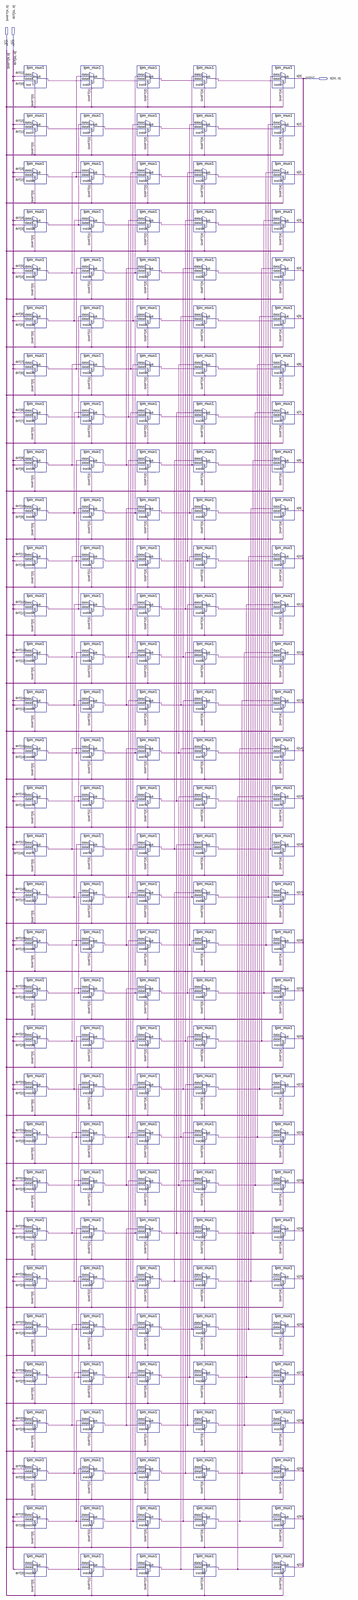
[diagram p0: schematic sheet, whole]
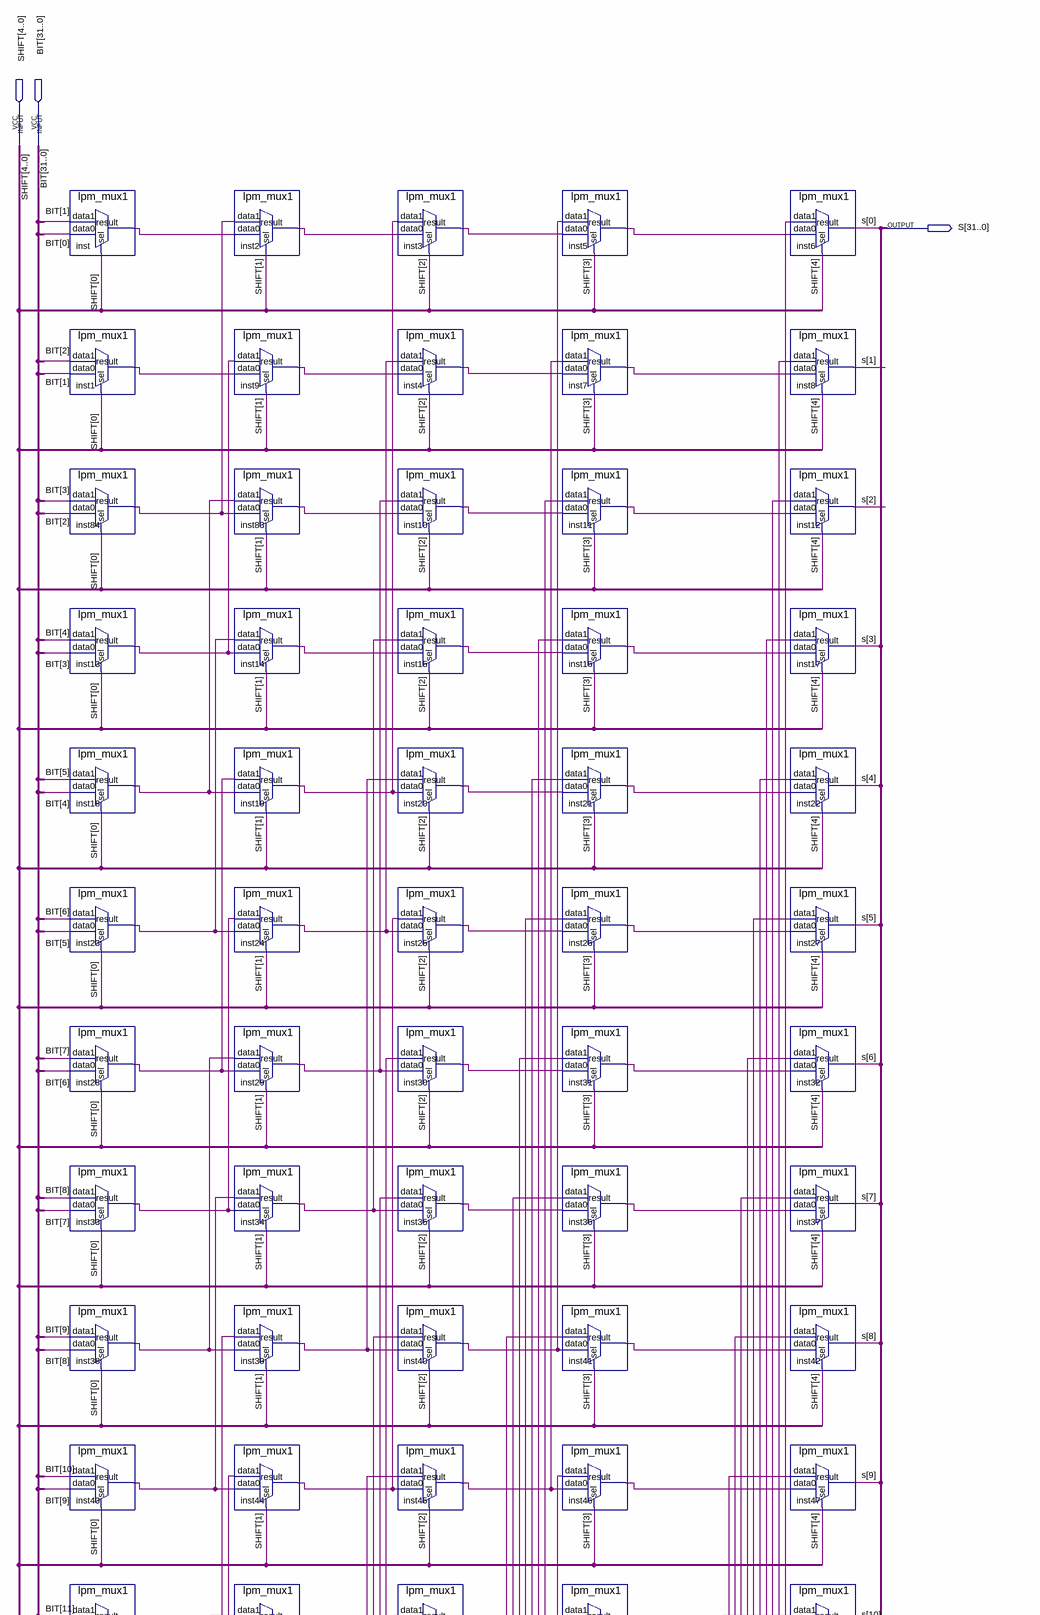
[diagram p1: schematic sheet, upper part]
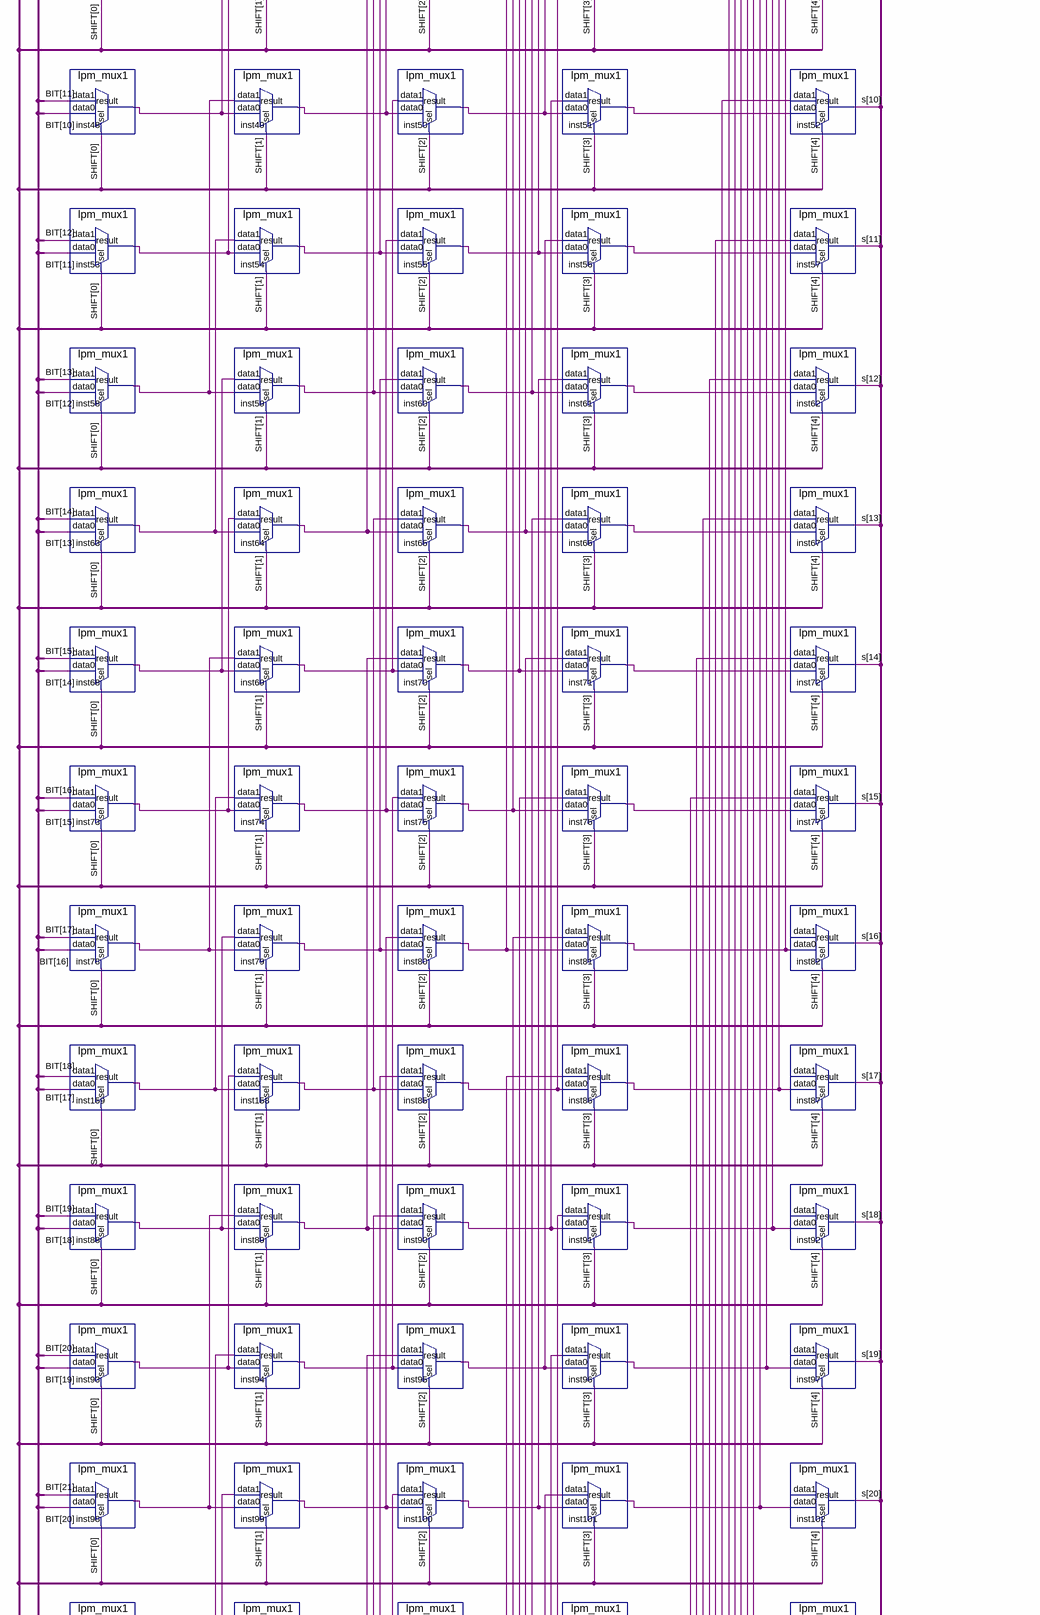
[diagram p2: schematic sheet, middle part]
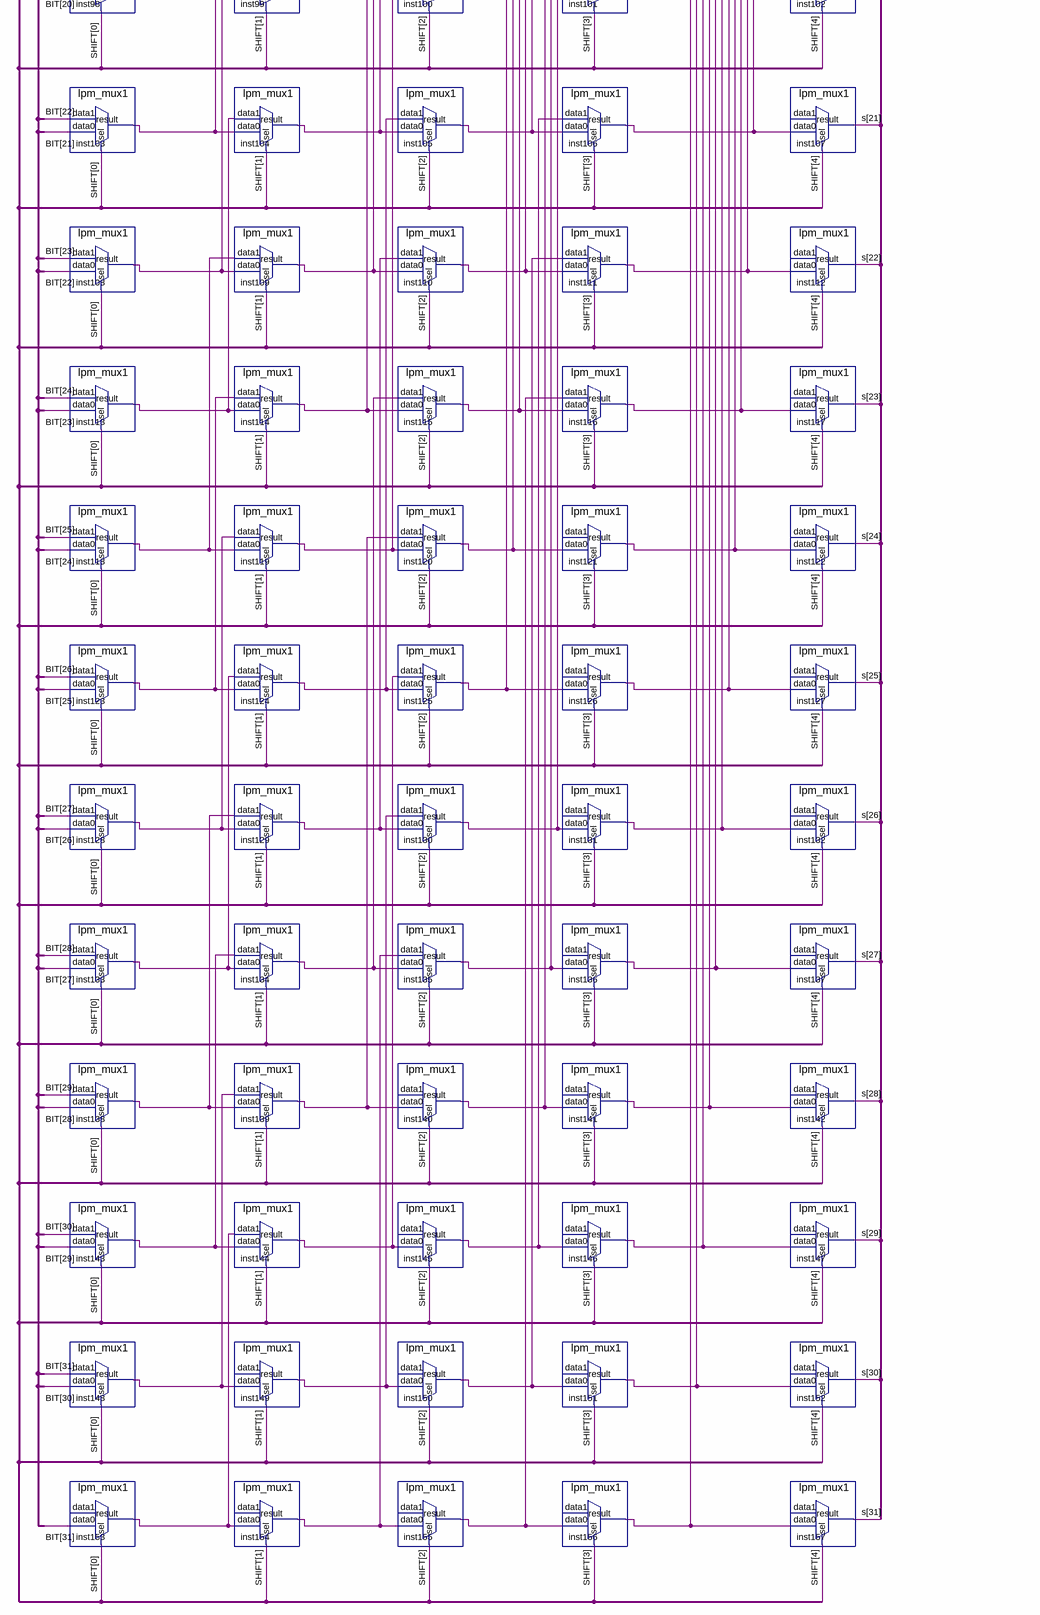
[diagram p3: schematic sheet, lower part]
// Quartus schematic SRL.bdf as structural Verilog: 160 symbols, 3 pins
module SRL (
  input  [4:0] SHIFT,
  input  [31:0] BIT,
  output [31:0] S
);

  wire inst1_result, inst2_result, inst3_result, inst4_result, inst5_result, inst7_result, inst9_result,
       inst10_result, inst11_result, inst13_result, inst14_result, inst15_result, inst16_result,
       inst18_result, inst19_result, inst20_result, inst21_result, inst23_result, inst24_result,
       inst25_result, inst26_result, inst28_result, inst29_result, inst30_result, inst31_result,
       inst33_result, inst34_result, inst35_result, inst36_result, inst38_result, inst39_result,
       inst40_result, inst41_result, inst43_result, inst44_result, inst45_result, inst46_result,
       inst48_result, inst49_result, inst50_result, inst51_result, inst53_result, inst54_result,
       inst55_result, inst56_result, inst58_result, inst59_result, inst60_result, inst61_result,
       inst63_result, inst64_result, inst65_result, inst66_result, inst68_result, inst69_result,
       inst70_result, inst71_result, inst73_result, inst74_result, inst75_result, inst76_result,
       inst78_result, inst79_result, inst80_result, inst81_result, inst83_result, inst84_result,
       inst85_result, inst86_result, inst88_result, inst89_result, inst90_result, inst91_result,
       inst93_result, inst94_result, inst95_result, inst96_result, inst98_result, inst99_result,
       inst100_result, inst101_result, inst103_result, inst104_result, inst105_result, inst106_result,
       inst108_result, inst109_result, inst110_result, inst111_result, inst113_result, inst114_result,
       inst115_result, inst116_result, inst118_result, inst119_result, inst120_result, inst121_result,
       inst123_result, inst124_result, inst125_result, inst126_result, inst128_result, inst129_result,
       inst130_result, inst131_result, inst133_result, inst134_result, inst135_result, inst136_result,
       inst138_result, inst139_result, inst140_result, inst141_result, inst143_result, inst144_result,
       inst145_result, inst146_result, inst148_result, inst149_result, inst150_result, inst151_result,
       inst153_result, inst154_result, inst155_result, inst156_result, inst158_result, inst159_result,
       inst_result;

  lpm_mux1 inst (.data1(BIT[1]), .data0(BIT[0]), .sel(SHIFT[0]), .result(inst_result));
  lpm_mux1 inst1 (.data1(BIT[2]), .data0(BIT[1]), .sel(SHIFT[0]), .result(inst1_result));
  lpm_mux1 inst84 (.data1(BIT[3]), .data0(BIT[2]), .sel(SHIFT[0]), .result(inst84_result));
  lpm_mux1 inst13 (.data1(BIT[4]), .data0(BIT[3]), .sel(SHIFT[0]), .result(inst13_result));
  lpm_mux1 inst18 (.data1(BIT[5]), .data0(BIT[4]), .sel(SHIFT[0]), .result(inst18_result));
  lpm_mux1 inst23 (.data1(BIT[6]), .data0(BIT[5]), .sel(SHIFT[0]), .result(inst23_result));
  lpm_mux1 inst28 (.data1(BIT[7]), .data0(BIT[6]), .sel(SHIFT[0]), .result(inst28_result));
  lpm_mux1 inst33 (.data1(BIT[8]), .data0(BIT[7]), .sel(SHIFT[0]), .result(inst33_result));
  lpm_mux1 inst38 (.data1(BIT[9]), .data0(BIT[8]), .sel(SHIFT[0]), .result(inst38_result));
  lpm_mux1 inst43 (.data1(BIT[10]), .data0(BIT[9]), .sel(SHIFT[0]), .result(inst43_result));
  lpm_mux1 inst48 (.data1(BIT[11]), .data0(BIT[10]), .sel(SHIFT[0]), .result(inst48_result));
  lpm_mux1 inst53 (.data1(BIT[12]), .data0(BIT[11]), .sel(SHIFT[0]), .result(inst53_result));
  lpm_mux1 inst58 (.data1(BIT[13]), .data0(BIT[12]), .sel(SHIFT[0]), .result(inst58_result));
  lpm_mux1 inst63 (.data1(BIT[14]), .data0(BIT[13]), .sel(SHIFT[0]), .result(inst63_result));
  lpm_mux1 inst68 (.data1(BIT[15]), .data0(BIT[14]), .sel(SHIFT[0]), .result(inst68_result));
  lpm_mux1 inst73 (.data1(BIT[16]), .data0(BIT[15]), .sel(SHIFT[0]), .result(inst73_result));
  lpm_mux1 inst78 (.data1(BIT[17]), .data0(BIT[16]), .sel(SHIFT[0]), .result(inst78_result));
  lpm_mux1 inst159 (.data1(BIT[18]), .data0(BIT[17]), .sel(SHIFT[0]), .result(inst159_result));
  lpm_mux1 inst88 (.data1(BIT[19]), .data0(BIT[18]), .sel(SHIFT[0]), .result(inst88_result));
  lpm_mux1 inst93 (.data1(BIT[20]), .data0(BIT[19]), .sel(SHIFT[0]), .result(inst93_result));
  lpm_mux1 inst98 (.data1(BIT[21]), .data0(BIT[20]), .sel(SHIFT[0]), .result(inst98_result));
  lpm_mux1 inst103 (.data1(BIT[22]), .data0(BIT[21]), .sel(SHIFT[0]), .result(inst103_result));
  lpm_mux1 inst108 (.data1(BIT[23]), .data0(BIT[22]), .sel(SHIFT[0]), .result(inst108_result));
  lpm_mux1 inst113 (.data1(BIT[24]), .data0(BIT[23]), .sel(SHIFT[0]), .result(inst113_result));
  lpm_mux1 inst118 (.data1(BIT[25]), .data0(BIT[24]), .sel(SHIFT[0]), .result(inst118_result));
  lpm_mux1 inst123 (.data1(BIT[26]), .data0(BIT[25]), .sel(SHIFT[0]), .result(inst123_result));
  lpm_mux1 inst128 (.data1(BIT[27]), .data0(BIT[26]), .sel(SHIFT[0]), .result(inst128_result));
  lpm_mux1 inst133 (.data1(BIT[28]), .data0(BIT[27]), .sel(SHIFT[0]), .result(inst133_result));
  lpm_mux1 inst138 (.data1(BIT[29]), .data0(BIT[28]), .sel(SHIFT[0]), .result(inst138_result));
  lpm_mux1 inst143 (.data1(BIT[30]), .data0(BIT[29]), .sel(SHIFT[0]), .result(inst143_result));
  lpm_mux1 inst148 (.data1(BIT[31]), .data0(BIT[30]), .sel(SHIFT[0]), .result(inst148_result));
  lpm_mux1 inst153 (.data0(BIT[31]), .sel(SHIFT[0]), .result(inst153_result));  // open: data1
  lpm_mux1 inst2 (.data1(inst84_result), .data0(inst_result), .sel(SHIFT[1]), .result(inst2_result));
  lpm_mux1 inst9 (.data1(inst13_result), .data0(inst1_result), .sel(SHIFT[1]), .result(inst9_result));
  lpm_mux1 inst83 (.data1(inst18_result), .data0(inst84_result), .sel(SHIFT[1]), .result(inst83_result));
  lpm_mux1 inst14 (.data1(inst23_result), .data0(inst13_result), .sel(SHIFT[1]), .result(inst14_result));
  lpm_mux1 inst19 (.data1(inst28_result), .data0(inst18_result), .sel(SHIFT[1]), .result(inst19_result));
  lpm_mux1 inst24 (.data1(inst33_result), .data0(inst23_result), .sel(SHIFT[1]), .result(inst24_result));
  lpm_mux1 inst29 (.data1(inst38_result), .data0(inst28_result), .sel(SHIFT[1]), .result(inst29_result));
  lpm_mux1 inst34 (.data1(inst43_result), .data0(inst33_result), .sel(SHIFT[1]), .result(inst34_result));
  lpm_mux1 inst39 (.data1(inst48_result), .data0(inst38_result), .sel(SHIFT[1]), .result(inst39_result));
  lpm_mux1 inst44 (.data1(inst53_result), .data0(inst43_result), .sel(SHIFT[1]), .result(inst44_result));
  lpm_mux1 inst49 (.data1(inst58_result), .data0(inst48_result), .sel(SHIFT[1]), .result(inst49_result));
  lpm_mux1 inst54 (.data1(inst63_result), .data0(inst53_result), .sel(SHIFT[1]), .result(inst54_result));
  lpm_mux1 inst59 (.data1(inst68_result), .data0(inst58_result), .sel(SHIFT[1]), .result(inst59_result));
  lpm_mux1 inst64 (.data1(inst73_result), .data0(inst63_result), .sel(SHIFT[1]), .result(inst64_result));
  lpm_mux1 inst69 (.data1(inst78_result), .data0(inst68_result), .sel(SHIFT[1]), .result(inst69_result));
  lpm_mux1 inst74 (.data1(inst159_result), .data0(inst73_result), .sel(SHIFT[1]), .result(inst74_result));
  lpm_mux1 inst79 (.data1(inst88_result), .data0(inst78_result), .sel(SHIFT[1]), .result(inst79_result));
  lpm_mux1 inst158 (.data1(inst93_result), .data0(inst159_result), .sel(SHIFT[1]), .result(inst158_result));
  lpm_mux1 inst89 (.data1(inst98_result), .data0(inst88_result), .sel(SHIFT[1]), .result(inst89_result));
  lpm_mux1 inst94 (.data1(inst103_result), .data0(inst93_result), .sel(SHIFT[1]), .result(inst94_result));
  lpm_mux1 inst99 (.data1(inst108_result), .data0(inst98_result), .sel(SHIFT[1]), .result(inst99_result));
  lpm_mux1 inst104 (.data1(inst113_result), .data0(inst103_result), .sel(SHIFT[1]), .result(inst104_result));
  lpm_mux1 inst109 (.data1(inst118_result), .data0(inst108_result), .sel(SHIFT[1]), .result(inst109_result));
  lpm_mux1 inst114 (.data1(inst123_result), .data0(inst113_result), .sel(SHIFT[1]), .result(inst114_result));
  lpm_mux1 inst119 (.data1(inst128_result), .data0(inst118_result), .sel(SHIFT[1]), .result(inst119_result));
  lpm_mux1 inst124 (.data1(inst133_result), .data0(inst123_result), .sel(SHIFT[1]), .result(inst124_result));
  lpm_mux1 inst129 (.data1(inst138_result), .data0(inst128_result), .sel(SHIFT[1]), .result(inst129_result));
  lpm_mux1 inst134 (.data1(inst143_result), .data0(inst133_result), .sel(SHIFT[1]), .result(inst134_result));
  lpm_mux1 inst139 (.data1(inst148_result), .data0(inst138_result), .sel(SHIFT[1]), .result(inst139_result));
  lpm_mux1 inst144 (.data1(inst153_result), .data0(inst143_result), .sel(SHIFT[1]), .result(inst144_result));
  lpm_mux1 inst149 (.data0(inst148_result), .sel(SHIFT[1]), .result(inst149_result));  // open: data1
  lpm_mux1 inst154 (.data0(inst153_result), .sel(SHIFT[1]), .result(inst154_result));  // open: data1
  lpm_mux1 inst3 (.data1(inst19_result), .data0(inst2_result), .sel(SHIFT[2]), .result(inst3_result));
  lpm_mux1 inst4 (.data1(inst24_result), .data0(inst9_result), .sel(SHIFT[2]), .result(inst4_result));
  lpm_mux1 inst10 (.data1(inst29_result), .data0(inst83_result), .sel(SHIFT[2]), .result(inst10_result));
  lpm_mux1 inst15 (.data1(inst34_result), .data0(inst14_result), .sel(SHIFT[2]), .result(inst15_result));
  lpm_mux1 inst20 (.data1(inst39_result), .data0(inst19_result), .sel(SHIFT[2]), .result(inst20_result));
  lpm_mux1 inst25 (.data1(inst44_result), .data0(inst24_result), .sel(SHIFT[2]), .result(inst25_result));
  lpm_mux1 inst30 (.data1(inst49_result), .data0(inst29_result), .sel(SHIFT[2]), .result(inst30_result));
  lpm_mux1 inst35 (.data1(inst54_result), .data0(inst34_result), .sel(SHIFT[2]), .result(inst35_result));
  lpm_mux1 inst40 (.data1(inst59_result), .data0(inst39_result), .sel(SHIFT[2]), .result(inst40_result));
  lpm_mux1 inst45 (.data1(inst64_result), .data0(inst44_result), .sel(SHIFT[2]), .result(inst45_result));
  lpm_mux1 inst50 (.data1(inst69_result), .data0(inst49_result), .sel(SHIFT[2]), .result(inst50_result));
  lpm_mux1 inst55 (.data1(inst74_result), .data0(inst54_result), .sel(SHIFT[2]), .result(inst55_result));
  lpm_mux1 inst60 (.data1(inst79_result), .data0(inst59_result), .sel(SHIFT[2]), .result(inst60_result));
  lpm_mux1 inst65 (.data1(inst158_result), .data0(inst64_result), .sel(SHIFT[2]), .result(inst65_result));
  lpm_mux1 inst70 (.data1(inst89_result), .data0(inst69_result), .sel(SHIFT[2]), .result(inst70_result));
  lpm_mux1 inst75 (.data1(inst94_result), .data0(inst74_result), .sel(SHIFT[2]), .result(inst75_result));
  lpm_mux1 inst80 (.data1(inst99_result), .data0(inst79_result), .sel(SHIFT[2]), .result(inst80_result));
  lpm_mux1 inst85 (.data1(inst104_result), .data0(inst158_result), .sel(SHIFT[2]), .result(inst85_result));
  lpm_mux1 inst90 (.data1(inst109_result), .data0(inst89_result), .sel(SHIFT[2]), .result(inst90_result));
  lpm_mux1 inst95 (.data1(inst114_result), .data0(inst94_result), .sel(SHIFT[2]), .result(inst95_result));
  lpm_mux1 inst100 (.data1(inst119_result), .data0(inst99_result), .sel(SHIFT[2]), .result(inst100_result));
  lpm_mux1 inst105 (.data1(inst124_result), .data0(inst104_result), .sel(SHIFT[2]), .result(inst105_result));
  lpm_mux1 inst110 (.data1(inst129_result), .data0(inst109_result), .sel(SHIFT[2]), .result(inst110_result));
  lpm_mux1 inst115 (.data1(inst134_result), .data0(inst114_result), .sel(SHIFT[2]), .result(inst115_result));
  lpm_mux1 inst120 (.data1(inst139_result), .data0(inst119_result), .sel(SHIFT[2]), .result(inst120_result));
  lpm_mux1 inst125 (.data1(inst144_result), .data0(inst124_result), .sel(SHIFT[2]), .result(inst125_result));
  lpm_mux1 inst130 (.data1(inst149_result), .data0(inst129_result), .sel(SHIFT[2]), .result(inst130_result));
  lpm_mux1 inst135 (.data1(inst154_result), .data0(inst134_result), .sel(SHIFT[2]), .result(inst135_result));
  lpm_mux1 inst140 (.data0(inst139_result), .sel(SHIFT[2]), .result(inst140_result));  // open: data1
  lpm_mux1 inst145 (.data0(inst144_result), .sel(SHIFT[2]), .result(inst145_result));  // open: data1
  lpm_mux1 inst150 (.data0(inst149_result), .sel(SHIFT[2]), .result(inst150_result));  // open: data1
  lpm_mux1 inst155 (.data0(inst154_result), .sel(SHIFT[2]), .result(inst155_result));  // open: data1
  lpm_mux1 inst5 (.data1(inst40_result), .data0(inst3_result), .sel(SHIFT[3]), .result(inst5_result));
  lpm_mux1 inst7 (.data1(inst45_result), .data0(inst4_result), .sel(SHIFT[3]), .result(inst7_result));
  lpm_mux1 inst11 (.data1(inst50_result), .data0(inst10_result), .sel(SHIFT[3]), .result(inst11_result));
  lpm_mux1 inst16 (.data1(inst55_result), .data0(inst15_result), .sel(SHIFT[3]), .result(inst16_result));
  lpm_mux1 inst21 (.data1(inst60_result), .data0(inst20_result), .sel(SHIFT[3]), .result(inst21_result));
  lpm_mux1 inst26 (.data1(inst65_result), .data0(inst25_result), .sel(SHIFT[3]), .result(inst26_result));
  lpm_mux1 inst31 (.data1(inst70_result), .data0(inst30_result), .sel(SHIFT[3]), .result(inst31_result));
  lpm_mux1 inst36 (.data1(inst75_result), .data0(inst35_result), .sel(SHIFT[3]), .result(inst36_result));
  lpm_mux1 inst41 (.data1(inst80_result), .data0(inst40_result), .sel(SHIFT[3]), .result(inst41_result));
  lpm_mux1 inst46 (.data1(inst85_result), .data0(inst45_result), .sel(SHIFT[3]), .result(inst46_result));
  lpm_mux1 inst51 (.data1(inst90_result), .data0(inst50_result), .sel(SHIFT[3]), .result(inst51_result));
  lpm_mux1 inst56 (.data1(inst95_result), .data0(inst55_result), .sel(SHIFT[3]), .result(inst56_result));
  lpm_mux1 inst61 (.data1(inst100_result), .data0(inst60_result), .sel(SHIFT[3]), .result(inst61_result));
  lpm_mux1 inst66 (.data1(inst105_result), .data0(inst65_result), .sel(SHIFT[3]), .result(inst66_result));
  lpm_mux1 inst71 (.data1(inst110_result), .data0(inst70_result), .sel(SHIFT[3]), .result(inst71_result));
  lpm_mux1 inst76 (.data1(inst115_result), .data0(inst75_result), .sel(SHIFT[3]), .result(inst76_result));
  lpm_mux1 inst81 (.data1(inst120_result), .data0(inst80_result), .sel(SHIFT[3]), .result(inst81_result));
  lpm_mux1 inst86 (.data1(inst125_result), .data0(inst85_result), .sel(SHIFT[3]), .result(inst86_result));
  lpm_mux1 inst91 (.data1(inst130_result), .data0(inst90_result), .sel(SHIFT[3]), .result(inst91_result));
  lpm_mux1 inst96 (.data1(inst135_result), .data0(inst95_result), .sel(SHIFT[3]), .result(inst96_result));
  lpm_mux1 inst101 (.data1(inst140_result), .data0(inst100_result), .sel(SHIFT[3]), .result(inst101_result));
  lpm_mux1 inst106 (.data1(inst145_result), .data0(inst105_result), .sel(SHIFT[3]), .result(inst106_result));
  lpm_mux1 inst111 (.data1(inst150_result), .data0(inst110_result), .sel(SHIFT[3]), .result(inst111_result));
  lpm_mux1 inst116 (.data1(inst155_result), .data0(inst115_result), .sel(SHIFT[3]), .result(inst116_result));
  lpm_mux1 inst121 (.data0(inst120_result), .sel(SHIFT[3]), .result(inst121_result));  // open: data1
  lpm_mux1 inst126 (.data0(inst125_result), .sel(SHIFT[3]), .result(inst126_result));  // open: data1
  lpm_mux1 inst131 (.data0(inst130_result), .sel(SHIFT[3]), .result(inst131_result));  // open: data1
  lpm_mux1 inst136 (.data0(inst135_result), .sel(SHIFT[3]), .result(inst136_result));  // open: data1
  lpm_mux1 inst141 (.data0(inst140_result), .sel(SHIFT[3]), .result(inst141_result));  // open: data1
  lpm_mux1 inst146 (.data0(inst145_result), .sel(SHIFT[3]), .result(inst146_result));  // open: data1
  lpm_mux1 inst151 (.data0(inst150_result), .sel(SHIFT[3]), .result(inst151_result));  // open: data1
  lpm_mux1 inst156 (.data0(inst155_result), .sel(SHIFT[3]), .result(inst156_result));  // open: data1
  lpm_mux1 inst6 (.data1(inst81_result), .data0(inst5_result), .sel(SHIFT[4]), .result(S[0]));
  lpm_mux1 inst8 (.data1(inst86_result), .data0(inst7_result), .sel(SHIFT[4]), .result(S[1]));
  lpm_mux1 inst12 (.data1(inst91_result), .data0(inst11_result), .sel(SHIFT[4]), .result(S[2]));
  lpm_mux1 inst17 (.data1(inst96_result), .data0(inst16_result), .sel(SHIFT[4]), .result(S[3]));
  lpm_mux1 inst22 (.data1(inst101_result), .data0(inst21_result), .sel(SHIFT[4]), .result(S[4]));
  lpm_mux1 inst27 (.data1(inst106_result), .data0(inst26_result), .sel(SHIFT[4]), .result(S[5]));
  lpm_mux1 inst32 (.data1(inst111_result), .data0(inst31_result), .sel(SHIFT[4]), .result(S[6]));
  lpm_mux1 inst37 (.data1(inst116_result), .data0(inst36_result), .sel(SHIFT[4]), .result(S[7]));
  lpm_mux1 inst42 (.data1(inst121_result), .data0(inst41_result), .sel(SHIFT[4]), .result(S[8]));
  lpm_mux1 inst47 (.data1(inst126_result), .data0(inst46_result), .sel(SHIFT[4]), .result(S[9]));
  lpm_mux1 inst52 (.data1(inst131_result), .data0(inst51_result), .sel(SHIFT[4]), .result(S[10]));
  lpm_mux1 inst57 (.data1(inst136_result), .data0(inst56_result), .sel(SHIFT[4]), .result(S[11]));
  lpm_mux1 inst62 (.data1(inst141_result), .data0(inst61_result), .sel(SHIFT[4]), .result(S[12]));
  lpm_mux1 inst67 (.data1(inst146_result), .data0(inst66_result), .sel(SHIFT[4]), .result(S[13]));
  lpm_mux1 inst72 (.data1(inst151_result), .data0(inst71_result), .sel(SHIFT[4]), .result(S[14]));
  lpm_mux1 inst77 (.data1(inst156_result), .data0(inst76_result), .sel(SHIFT[4]), .result(S[15]));
  lpm_mux1 inst82 (.data0(inst81_result), .sel(SHIFT[4]), .result(S[16]));  // open: data1
  lpm_mux1 inst87 (.data0(inst86_result), .sel(SHIFT[4]), .result(S[17]));  // open: data1
  lpm_mux1 inst92 (.data0(inst91_result), .sel(SHIFT[4]), .result(S[18]));  // open: data1
  lpm_mux1 inst97 (.data0(inst96_result), .sel(SHIFT[4]), .result(S[19]));  // open: data1
  lpm_mux1 inst102 (.data0(inst101_result), .sel(SHIFT[4]), .result(S[20]));  // open: data1
  lpm_mux1 inst107 (.data0(inst106_result), .sel(SHIFT[4]), .result(S[21]));  // open: data1
  lpm_mux1 inst112 (.data0(inst111_result), .sel(SHIFT[4]), .result(S[22]));  // open: data1
  lpm_mux1 inst117 (.data0(inst116_result), .sel(SHIFT[4]), .result(S[23]));  // open: data1
  lpm_mux1 inst122 (.data0(inst121_result), .sel(SHIFT[4]), .result(S[24]));  // open: data1
  lpm_mux1 inst127 (.data0(inst126_result), .sel(SHIFT[4]), .result(S[25]));  // open: data1
  lpm_mux1 inst132 (.data0(inst131_result), .sel(SHIFT[4]), .result(S[26]));  // open: data1
  lpm_mux1 inst137 (.data0(inst136_result), .sel(SHIFT[4]), .result(S[27]));  // open: data1
  lpm_mux1 inst142 (.data0(inst141_result), .sel(SHIFT[4]), .result(S[28]));  // open: data1
  lpm_mux1 inst147 (.data0(inst146_result), .sel(SHIFT[4]), .result(S[29]));  // open: data1
  lpm_mux1 inst152 (.data0(inst151_result), .sel(SHIFT[4]), .result(S[30]));  // open: data1
  lpm_mux1 inst157 (.data0(inst156_result), .sel(SHIFT[4]), .result(S[31]));  // open: data1
endmodule
